# Altium schematic sheet STM32F4.SchDoc
size A4; SheetNumber: 2; SheetTotal: 4
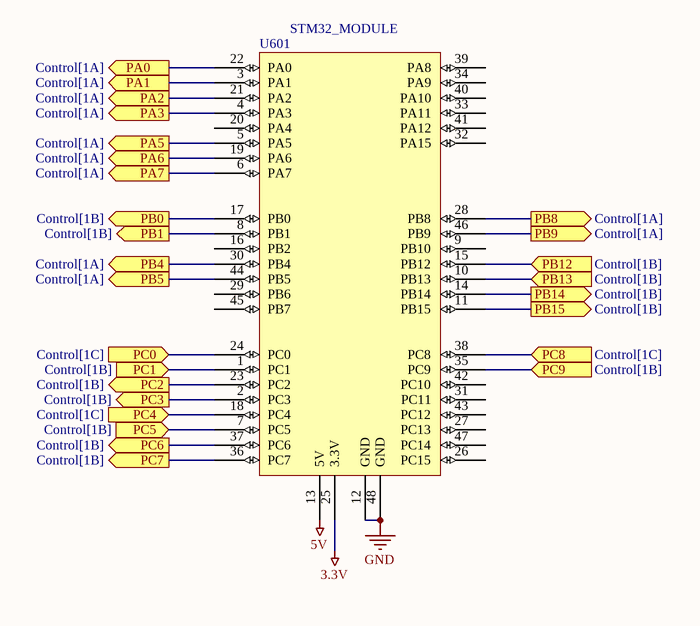
[diagram p0: STM32F4.SchDoc]

## Parts
U601  STM32_MODULE  [DIP_STM32_MODULE]

## Ports
PA0 (out, see Control[1A]), PA1 (out, see Control[1A]), PA2 (out, see Control[1A]), PA3 (out, see Control[1A]), PA5 (out, see Control[1A]), PA6 (out, see Control[1A]), PA7 (out, see Control[1A]), PB0 (out, see Control[1B]), PB1 (out, see Control[1B]), PB4 (out, see Control[1A]), PB5 (out, see Control[1A]), PB8 (out, see Control[1A]), PB9 (out, see Control[1A]), PB12 (in, see Control[1B]), PB13 (in, see Control[1B]), PB14 (out, see Control[1B]), PB15 (out, see Control[1B]), PC0 (in, see Control[1C]), PC1 (in, see Control[1B]), PC2 (out, see Control[1B]), PC3 (out, see Control[1B]), PC4 (in, see Control[1C]), PC5 (in, see Control[1B]), PC6 (out, see Control[1B]), PC7 (out, see Control[1B]), PC8 (in, see Control[1C]), PC9 (in, see Control[1B])

## Nets
3.3V: U601.25(3.3V)
5V: U601.13(5V)
GND: U601.12(GND) U601.48(GND)
PA0: U601.22(PA0) ; port PA0
PA1: U601.3(PA1) ; port PA1
PA2: U601.21(PA2) ; port PA2
PA3: U601.4(PA3) ; port PA3
PA5: U601.5(PA5) ; port PA5
PA6: U601.19(PA6) ; port PA6
PA7: U601.6(PA7) ; port PA7
PB0: U601.17(PB0) ; port PB0
PB1: U601.8(PB1) ; port PB1
PB4: U601.30(PB4) ; port PB4
PB5: U601.44(PB5) ; port PB5
PB8: U601.28(PB8) ; port PB8
PB9: U601.46(PB9) ; port PB9
PB12: U601.15(PB12) ; port PB12
PB13: U601.10(PB13) ; port PB13
PB14: U601.14(PB14) ; port PB14
PB15: U601.11(PB15) ; port PB15
PC0: U601.24(PC0) ; port PC0
PC1: U601.1(PC1) ; port PC1
PC2: U601.23(PC2) ; port PC2
PC3: U601.2(PC3) ; port PC3
PC4: U601.18(PC4) ; port PC4
PC5: U601.7(PC5) ; port PC5
PC6: U601.37(PC6) ; port PC6
PC7: U601.36(PC7) ; port PC7
PC8: U601.38(PC8) ; port PC8
PC9: U601.35(PC9) ; port PC9

Not connected (* = marked no-connect by the designer): U601 9(PB10) 16(PB2) 20(PA4) 26(PC15) 27(PC13) 29(PB6) 31(PC11) 32(PA15) 33(PA11) 34(PA9) 39(PA8) 40(PA10) 41(PA12) 42(PC10) 43(PC12) 45(PB7) 47(PC14)

## Library data of the parts
U601 = CMP-021-000010-1: processor; Source: robit_ic.SchLib; Design Item ID: STM32_MODULE